# Altium schematic sheet PM12_Power.SchDoc: FIT_PM12 board
size 420 x 297 mm; CheckedBy: G.Kasprowicz; Author: INR Moscow; CompanyName: WUT ISE; DrawnBy: M.Podgórski; Organization: WUT ISE; Address1: PW ISE; Address2: Nowowiejska 15/19 00-665 Warsaw; Address3: gkasprow@gmail.com; DocumentNumber: 11; Revision: 2; SheetNumber: 10; SheetTotal: 25; ModifiedBy: -; CheckedDate: -; Title2: PSU subsystem; DivGrp: WUT ISE; Designer: INR RAS; ModifiedDate: -; ProjectName: Sensor Box
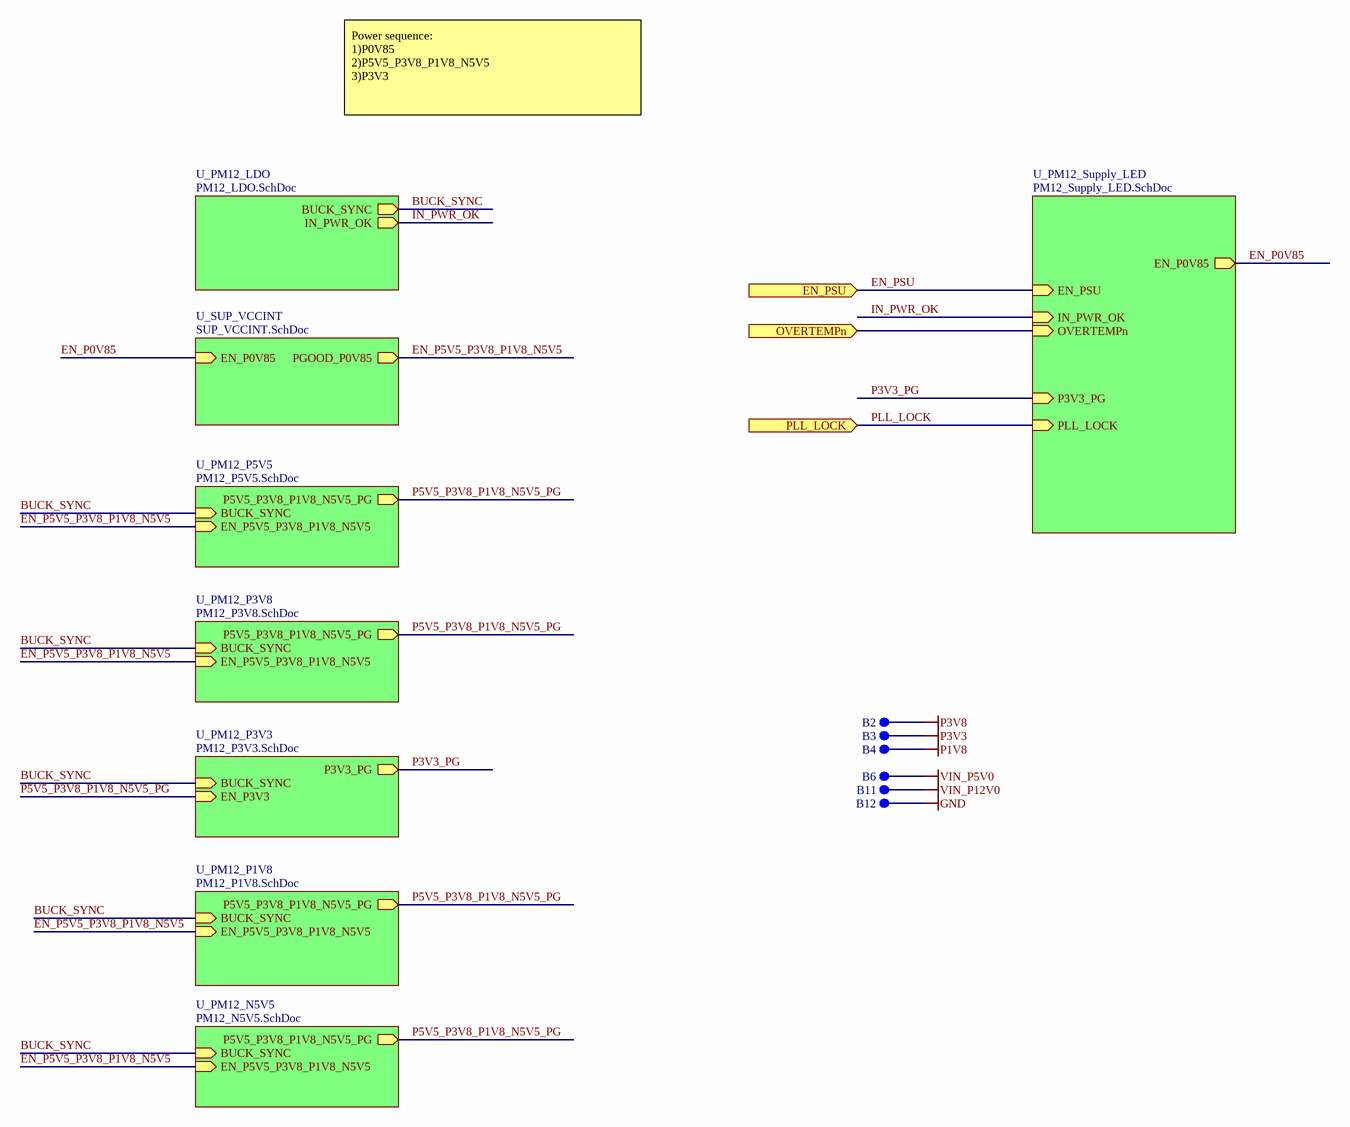
[diagram p0: PM12_Power.SchDoc]

## Parts
B2  SMD Pad  [C100]  (value not drawn)  (no BOM)
B3  SMD Pad  [C100]  (value not drawn)  (no BOM)
B4  SMD Pad  [C100]  (value not drawn)  (no BOM)
B6  SMD Pad  [C100]  (value not drawn)  (no BOM)
B11  SMD Pad  [C100]  (value not drawn)  (no BOM)
B12  SMD Pad  [C100]  (value not drawn)  (no BOM)

## Sub-sheets
U_PM12_LDO = PM12_LDO.SchDoc: IN_PWR_OK (out), BUCK_SYNC (out)
U_PM12_N5V5 = PM12_N5V5.SchDoc: BUCK_SYNC (in), EN_P5V5_P3V8_P1V8_N5V5 (in), P5V5_P3V8_P1V8_N5V5_PG (out)
U_PM12_P1V8 = PM12_P1V8.SchDoc: BUCK_SYNC (in), EN_P5V5_P3V8_P1V8_N5V5 (in), P5V5_P3V8_P1V8_N5V5_PG (out)
U_PM12_P3V3 = PM12_P3V3.SchDoc: BUCK_SYNC (in), EN_P3V3 (in), P3V3_PG (out)
U_PM12_P3V8 = PM12_P3V8.SchDoc: BUCK_SYNC (in), EN_P5V5_P3V8_P1V8_N5V5 (in), P5V5_P3V8_P1V8_N5V5_PG (out)
U_PM12_P5V5 = PM12_P5V5.SchDoc: BUCK_SYNC (in), EN_P5V5_P3V8_P1V8_N5V5 (in), P5V5_P3V8_P1V8_N5V5_PG (out)
U_PM12_Supply_LED = PM12_Supply_LED.SchDoc: IN_PWR_OK (in), PLL_LOCK (in), EN_PSU (in), EN_P0V85 (out), P3V3_PG (in), OVERTEMPn (in)
U_SUP_VCCINT = SUP_VCCINT.SchDoc: EN_P0V85 (in), PGOOD_P0V85 (out)

## Ports
EN_PSU (in), OVERTEMPn (in), PLL_LOCK (in)

## Nets
GND: B12.1
P1V8: B4.1
P3V3: B3.1
P3V8: B2.1
VIN_P5V0: B6.1
VIN_P12V0: B11.1
BUCK_SYNC: sheet U_PM12_LDO/BUCK_SYNC, sheet U_PM12_P3V8/BUCK_SYNC, sheet U_PM12_P3V3/BUCK_SYNC, sheet U_PM12_N5V5/BUCK_SYNC, sheet U_PM12_P5V5/BUCK_SYNC, sheet U_PM12_P1V8/BUCK_SYNC
EN_P0V85: sheet U_PM12_Supply_LED/EN_P0V85, sheet U_SUP_VCCINT/EN_P0V85
EN_P5V5_P3V8_P1V8_N5V5: sheet U_PM12_P3V8/EN_P5V5_P3V8_P1V8_N5V5, sheet U_PM12_N5V5/EN_P5V5_P3V8_P1V8_N5V5, sheet U_PM12_P5V5/EN_P5V5_P3V8_P1V8_N5V5, sheet U_PM12_P1V8/EN_P5V5_P3V8_P1V8_N5V5, sheet U_SUP_VCCINT/PGOOD_P0V85
EN_PSU: port EN_PSU, sheet U_PM12_Supply_LED/EN_PSU
IN_PWR_OK: sheet U_PM12_LDO/IN_PWR_OK, sheet U_PM12_Supply_LED/IN_PWR_OK
OVERTEMPn: port OVERTEMPn, sheet U_PM12_Supply_LED/OVERTEMPn
P3V3_PG: sheet U_PM12_Supply_LED/P3V3_PG, sheet U_PM12_P3V3/P3V3_PG
P5V5_P3V8_P1V8_N5V5_PG: sheet U_PM12_P3V8/P5V5_P3V8_P1V8_N5V5_PG, sheet U_PM12_P3V3/EN_P3V3, sheet U_PM12_N5V5/P5V5_P3V8_P1V8_N5V5_PG, sheet U_PM12_P5V5/P5V5_P3V8_P1V8_N5V5_PG, sheet U_PM12_P1V8/P5V5_P3V8_P1V8_N5V5_PG
PLL_LOCK: port PLL_LOCK, sheet U_PM12_Supply_LED/PLL_LOCK

## Notes on the sheet
- Power sequence:
  1)P0V85
  2)P5V5_P3V8_P1V8_N5V5
  3)P3V3
- Project/Equipment
- Document
- Designer
- Drawn by
- Check.by
- Copyright WUT ISE 2024.
  This documentation describes Open Hardware and is licensed under the CERN OHL-W v.2.0. You may redistribute and modify this documentation under the terms of the CERN OHL-W v.2.0. (http://ohwr.org/CERNOHL). This documentation is distributed WITHOUT ANY EXPRESS OR IMPLIED WARRANTY, INCLUDING OF MERCHANTABILITY, SATISFACTORY QUALITY AND FITNESS FOR A PARTICULAR PURPOSE. Please see the CERN OHL v.2.0 for applicable conditions.
- Contact
- File
- Last Mod.
- Print Date
- Sheet
- Size
- A3
- of
- Rev

## Library data of the parts
B2-B4 B6 B11 B12 = SMD_PAD_D1MM: Pad; Part Description: 1mm Diameter SMD Pad; Mounted: No; Part Number: SMD_PAD_D1MM; Component Type: Standard (No BOM); Pin Count: 1; Family: SMD Pad; Socket: No; SMD: Yes; Sense: No; Status: None; ComponentHeight: 0mm; HelpURL: Undefined; Author: CERN DEM JLC; CreateDate: 10.10.2017; LatestRevisionDate: 10.10.2017; PackageDescription: 1mm Diameter SMD Pad